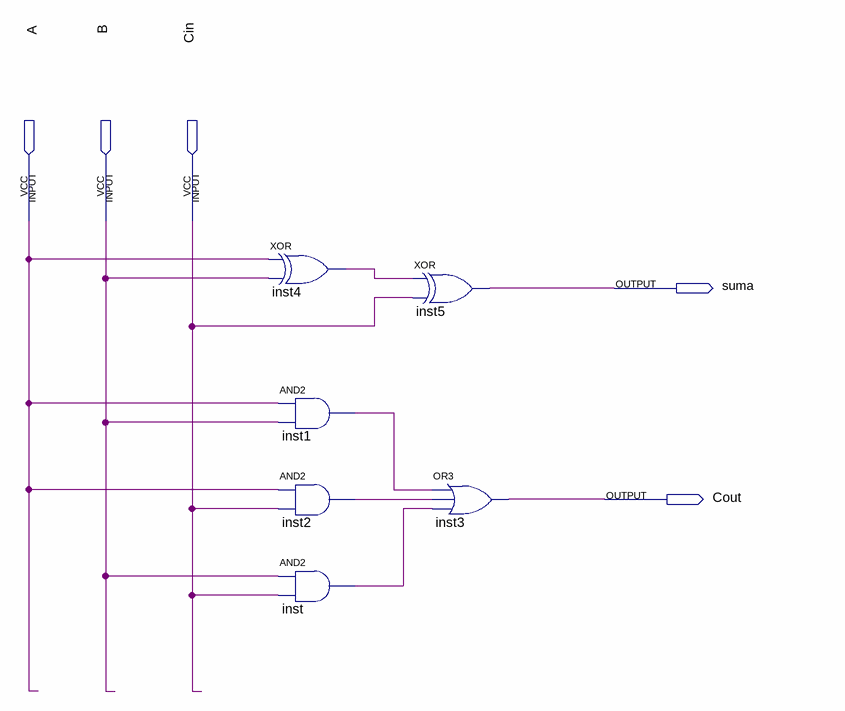
[diagram p0: schematic sheet]
// Quartus schematic fullader.bdf as structural Verilog: 6 symbols, 5 pins
module fullader (
  input  A,
  input  B,
  input  Cin,
  output suma,
  output Cout
);

  wire inst1_out, inst2_out, inst4_out, inst_out;

  xor inst4 (inst4_out, A, B);
  and inst1 (inst1_out, A, B);
  and inst2 (inst2_out, A, Cin);
  and inst (inst_out, B, Cin);
  xor inst5 (suma, inst4_out, Cin);
  or inst3 (Cout, inst1_out, inst2_out, inst_out);
endmodule
